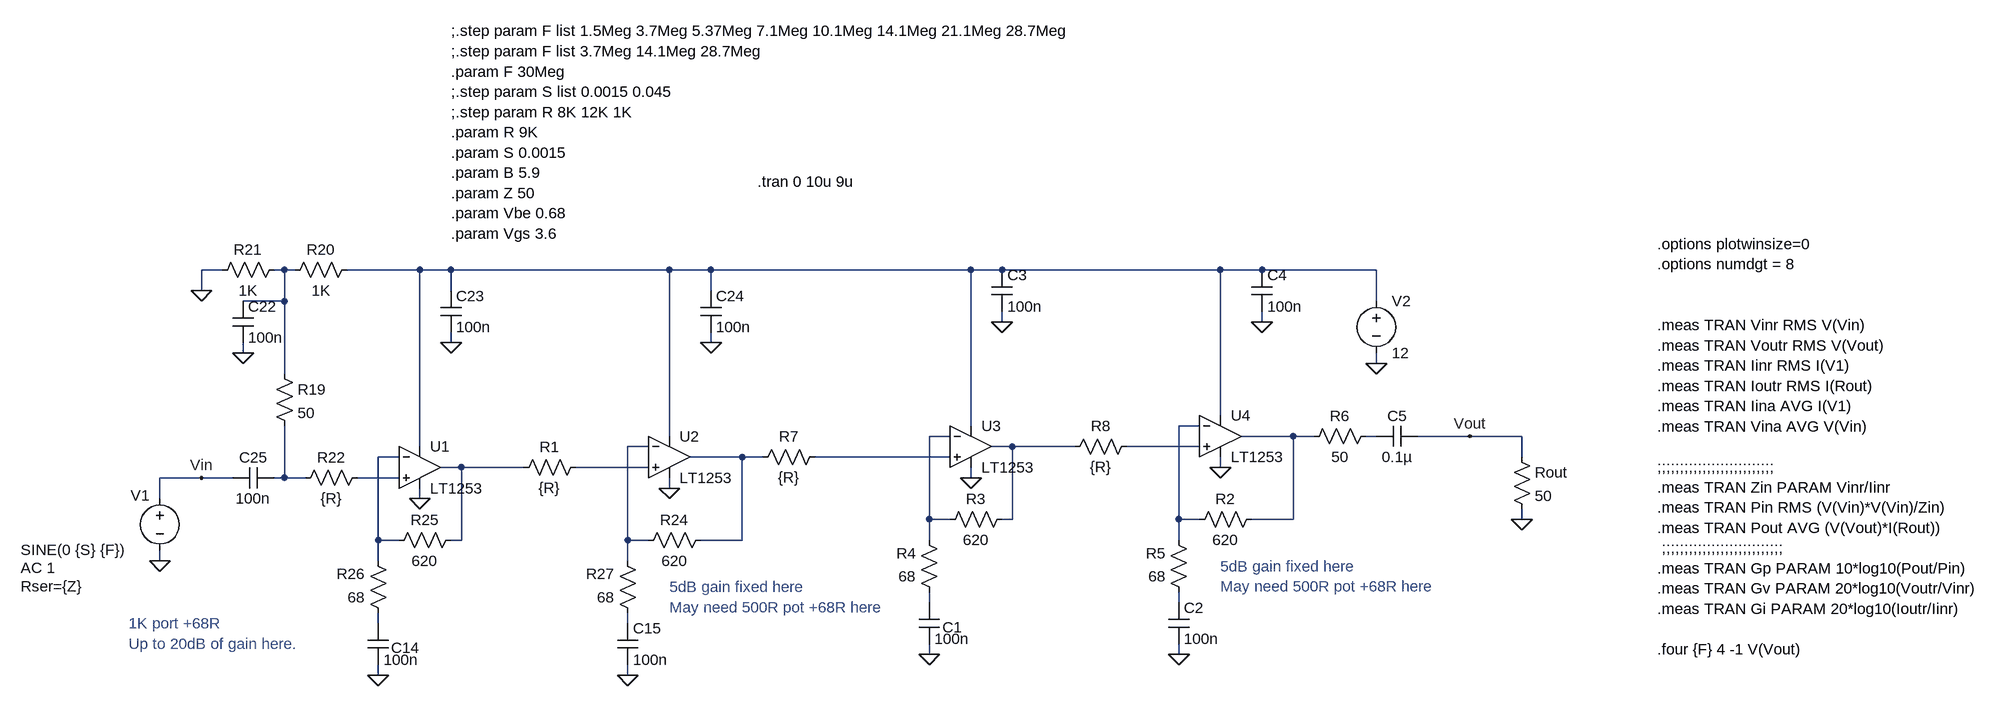
[diagram p0: schematic LT1253 testing.asc]
LT1253 testing.asc, the LTspice schematic file:
Version 4
SHEET 1 3748 1760
WIRE -2544 -288 -2576 -288
WIRE -2448 -288 -2464 -288
WIRE -2432 -288 -2448 -288
WIRE -2240 -288 -2352 -288
WIRE -2192 -288 -2240 -288
WIRE -1856 -288 -2192 -288
WIRE -1792 -288 -1856 -288
WIRE -1392 -288 -1792 -288
WIRE -1344 -288 -1392 -288
WIRE -1008 -288 -1344 -288
WIRE -944 -288 -1008 -288
WIRE -768 -288 -944 -288
WIRE -2576 -256 -2576 -288
WIRE -2192 -256 -2192 -288
WIRE -1792 -256 -1792 -288
WIRE -2448 -240 -2448 -288
WIRE -2448 -240 -2512 -240
WIRE -768 -240 -768 -288
WIRE -1344 -208 -1344 -224
WIRE -944 -208 -944 -224
WIRE -2192 -176 -2192 -192
WIRE -1792 -176 -1792 -192
WIRE -2512 -160 -2512 -176
WIRE -768 -144 -768 -160
WIRE -2448 -128 -2448 -240
WIRE -1008 -64 -1008 -288
WIRE -1392 -48 -1392 -288
WIRE -1040 -48 -1072 -48
WIRE -1856 -32 -1856 -288
WIRE -1424 -32 -1456 -32
WIRE -896 -32 -976 -32
WIRE -864 -32 -896 -32
WIRE -768 -32 -784 -32
WIRE -624 -32 -704 -32
WIRE -544 -32 -624 -32
WIRE -2240 -16 -2240 -288
WIRE -1888 -16 -1920 -16
WIRE -1328 -16 -1360 -16
WIRE -1232 -16 -1328 -16
WIRE -1040 -16 -1152 -16
WIRE -2272 0 -2304 0
WIRE -1744 0 -1824 0
WIRE -1712 0 -1744 0
WIRE -1424 0 -1632 0
WIRE -544 0 -544 -32
WIRE -2176 16 -2208 16
WIRE -2080 16 -2176 16
WIRE -1888 16 -2000 16
WIRE -1008 16 -1008 0
WIRE -2576 32 -2640 32
WIRE -2528 32 -2576 32
WIRE -2448 32 -2448 -48
WIRE -2448 32 -2464 32
WIRE -2416 32 -2448 32
WIRE -2272 32 -2336 32
WIRE -1392 32 -1392 16
WIRE -1856 48 -1856 32
WIRE -2640 64 -2640 32
WIRE -2240 64 -2240 48
WIRE -1456 96 -1456 -32
WIRE -1424 96 -1456 96
WIRE -1328 96 -1328 -16
WIRE -1328 96 -1344 96
WIRE -1072 96 -1072 -48
WIRE -1040 96 -1072 96
WIRE -896 96 -896 -32
WIRE -896 96 -960 96
WIRE -544 96 -544 80
WIRE -2304 128 -2304 0
WIRE -2272 128 -2304 128
WIRE -2176 128 -2176 16
WIRE -2176 128 -2192 128
WIRE -1920 128 -1920 -16
WIRE -1888 128 -1920 128
WIRE -1744 128 -1744 0
WIRE -1744 128 -1808 128
WIRE -1456 128 -1456 96
WIRE -1072 128 -1072 96
WIRE -2640 160 -2640 144
WIRE -2304 160 -2304 128
WIRE -1920 160 -1920 128
WIRE -1456 224 -1456 208
WIRE -1072 224 -1072 208
WIRE -2304 256 -2304 240
WIRE -1920 256 -1920 240
WIRE -1456 304 -1456 288
WIRE -1072 304 -1072 288
WIRE -2304 336 -2304 320
WIRE -1920 336 -1920 320
FLAG -2640 160 0
FLAG -2576 32 Vin
FLAG -2192 -176 0
FLAG -2512 -160 0
FLAG -2240 64 0
FLAG -1856 48 0
FLAG -1920 336 0
FLAG -1792 -176 0
FLAG -2576 -256 0
FLAG -2304 336 0
FLAG -1344 -208 0
FLAG -1392 32 0
FLAG -1008 16 0
FLAG -1072 304 0
FLAG -944 -208 0
FLAG -1456 304 0
FLAG -544 96 0
FLAG -624 -32 Vout
FLAG -768 -144 0
SYMBOL voltage -2640 48 R0
WINDOW 0 -45 11 Left 2
WINDOW 3 -214 95 Left 2
WINDOW 123 -214 123 Left 2
WINDOW 39 -214 151 Left 2
SYMATTR InstName V1
SYMATTR Value SINE(0 {S} {F})
SYMATTR Value2 AC 1
SYMATTR SpiceLine Rser={Z}
SYMBOL voltage -768 -256 R0
WINDOW 123 0 0 Left 0
WINDOW 39 0 0 Left 0
SYMATTR InstName V2
SYMATTR Value 12
SYMBOL Opamps\\LT1253 -2240 -48 R0
SYMATTR InstName U1
SYMBOL Opamps\\LT1253 -1856 -64 R0
SYMATTR InstName U2
SYMBOL res -2464 -144 R0
SYMATTR InstName R19
SYMATTR Value 50
SYMBOL res -2336 -304 R90
WINDOW 0 0 56 VBottom 2
WINDOW 3 32 56 VTop 2
SYMATTR InstName R20
SYMATTR Value 1K
SYMBOL res -2448 -304 R90
WINDOW 0 0 56 VBottom 2
WINDOW 3 32 56 VTop 2
SYMATTR InstName R21
SYMATTR Value 1K
SYMBOL res -2320 16 R90
WINDOW 0 0 56 VBottom 2
WINDOW 3 32 56 VTop 2
SYMATTR InstName R22
SYMATTR Value {R}
SYMBOL res -1792 112 R90
WINDOW 0 0 56 VBottom 2
WINDOW 3 32 56 VTop 2
SYMATTR InstName R24
SYMATTR Value 620
SYMBOL res -2176 112 R90
WINDOW 0 0 56 VBottom 2
WINDOW 3 32 56 VTop 2
SYMATTR InstName R25
SYMATTR Value 620
SYMBOL res -2288 256 R180
WINDOW 0 36 76 Left 2
WINDOW 3 36 40 Left 2
SYMATTR InstName R26
SYMATTR Value 68
SYMBOL res -1904 256 R180
WINDOW 0 36 76 Left 2
WINDOW 3 36 40 Left 2
SYMATTR InstName R27
SYMATTR Value 68
SYMBOL cap -2320 256 R0
WINDOW 0 36 38 Left 2
SYMATTR InstName C14
SYMATTR Value 100n
SYMBOL cap -1936 256 R0
SYMATTR InstName C15
SYMATTR Value 100n
SYMBOL cap -2528 -240 R0
SYMATTR InstName C22
SYMATTR Value 100n
SYMBOL cap -2208 -256 R0
SYMATTR InstName C23
SYMATTR Value 100n
SYMBOL cap -1808 -256 R0
SYMATTR InstName C24
SYMATTR Value 100n
SYMBOL cap -2464 16 R90
WINDOW 0 0 32 VBottom 2
WINDOW 3 32 32 VTop 2
SYMATTR InstName C25
SYMATTR Value 100n
SYMBOL Opamps\\LT1253 -1392 -80 R0
SYMATTR InstName U3
SYMBOL Opamps\\LT1253 -1008 -96 R0
SYMATTR InstName U4
SYMBOL res -944 80 R90
WINDOW 0 0 56 VBottom 2
WINDOW 3 32 56 VTop 2
SYMATTR InstName R2
SYMATTR Value 620
SYMBOL res -1328 80 R90
WINDOW 0 0 56 VBottom 2
WINDOW 3 32 56 VTop 2
SYMATTR InstName R3
SYMATTR Value 620
SYMBOL res -1440 224 R180
WINDOW 0 36 76 Left 2
WINDOW 3 36 40 Left 2
SYMATTR InstName R4
SYMATTR Value 68
SYMBOL res -1056 224 R180
WINDOW 0 36 76 Left 2
WINDOW 3 36 40 Left 2
SYMATTR InstName R5
SYMATTR Value 68
SYMBOL cap -1472 224 R0
WINDOW 0 36 38 Left 2
SYMATTR InstName C1
SYMATTR Value 100n
SYMBOL cap -1088 224 R0
SYMATTR InstName C2
SYMATTR Value 100n
SYMBOL cap -1360 -288 R0
SYMATTR InstName C3
SYMATTR Value 100n
SYMBOL cap -960 -288 R0
SYMATTR InstName C4
SYMATTR Value 100n
SYMBOL res -768 -48 R90
WINDOW 0 0 56 VBottom 2
WINDOW 3 32 56 VTop 2
SYMATTR InstName R6
SYMATTR Value 50
SYMBOL cap -704 -48 R90
WINDOW 0 0 32 VBottom 2
WINDOW 3 32 32 VTop 2
SYMATTR InstName C5
SYMATTR Value 0.1µ
SYMBOL res -560 -16 R0
SYMATTR InstName Rout
SYMATTR Value 50
SYMBOL res -1984 0 R90
WINDOW 0 0 56 VBottom 2
WINDOW 3 32 56 VTop 2
SYMATTR InstName R1
SYMATTR Value {R}
SYMBOL res -1616 -16 R90
WINDOW 0 0 56 VBottom 2
WINDOW 3 32 56 VTop 2
SYMATTR InstName R7
SYMATTR Value {R}
SYMBOL res -1136 -32 R90
WINDOW 0 0 56 VBottom 2
WINDOW 3 32 56 VTop 2
SYMATTR InstName R8
SYMATTR Value {R}
TEXT -336 -328 Left 2 !.options plotwinsize=0\n.options numdgt = 8\n \n \n.meas TRAN Vinr RMS V(Vin)\n.meas TRAN Voutr RMS V(Vout)\n.meas TRAN Iinr RMS I(V1)\n.meas TRAN Ioutr RMS I(Rout)\n.meas TRAN Iina AVG I(V1)\n.meas TRAN Vina AVG V(Vin)\n \n;;;;;;;;;;;;;;;;;;;;;;;;;;\n.meas TRAN Zin PARAM Vinr/Iinr\n.meas TRAN Pin RMS (V(Vin)*V(Vin)/Zin)\n.meas TRAN Pout AVG (V(Vout)*I(Rout))\n ;;;;;;;;;;;;;;;;;;;;;;;;;;;\n.meas TRAN Gp PARAM 10*log10(Pout/Pin)\n.meas TRAN Gv PARAM 20*log10(Voutr/Vinr)\n.meas TRAN Gi PARAM 20*log10(Ioutr/Iinr)\n \n.four {F} 4 -1 V(Vout)
TEXT -2192 -656 Left 2 !;.step param F list 1.5Meg 3.7Meg 5.37Meg 7.1Meg 10.1Meg 14.1Meg 21.1Meg 28.7Meg\n;.step param F list 3.7Meg 14.1Meg 28.7Meg\n.param F 30Meg\n;.step param S list 0.0015 0.045\n;.step param R 8K 12K 1K\n.param R 9K\n.param S 0.0015\n.param B 5.9\n.param Z 50\n.param Vbe 0.68\n.param Vgs 3.6
TEXT -1856 200 Left 2 ;5dB gain fixed here\nMay need 500R pot +68R here
TEXT -2688 256 Left 2 ;1K port +68R  \nUp to 20dB of gain here.
TEXT -1008 168 Left 2 ;5dB gain fixed here\nMay need 500R pot +68R here
TEXT -1720 -424 Left 2 !.tran 0 10u 9u

The netlist it stands for:
* LT1253 testing.asc
V1 Vin 0 SINE(0 {S} {F}) AC 1 Rser={Z}
V2 N002 0 12
XU1 N016 N010 N002 0 N013 LT1253  ; pins In+ In- V+ V- OUT
XU2 N014 N007 N002 0 N011 LT1253  ; pins In+ In- V+ V- OUT
R19 N001 N015 50
R20 N002 N001 1K
R21 N001 0 1K
R22 N016 N015 {R}
R24 N011 N007 620
R25 N013 N010 620
R26 N019 N010 68
R27 N020 N007 68
C14 N019 0 100n
C15 N020 0 100n
C22 N001 0 100n
C23 N002 0 100n
C24 N002 0 100n
C25 N015 Vin 100n
XU3 N012 N004 N002 0 N008 LT1253  ; pins In+ In- V+ V- OUT
XU4 N009 N003 N002 0 N005 LT1253  ; pins In+ In- V+ V- OUT
R2 N005 N003 620
R3 N008 N004 620
R4 N017 N004 68
R5 N018 N003 68
C1 N017 0 100n
C2 N018 0 100n
C3 N002 0 100n
C4 N002 0 100n
R6 N006 N005 50
C5 Vout N006 0.1µ
Rout Vout 0 50
R1 N014 N013 {R}
R7 N012 N011 {R}
R8 N009 N008 {R}
.options plotwinsize=0
.options numdgt = 8
.meas TRAN Vinr RMS V(Vin)
.meas TRAN Voutr RMS V(Vout)
.meas TRAN Iinr RMS I(V1)
.meas TRAN Ioutr RMS I(Rout)
.meas TRAN Iina AVG I(V1)
.meas TRAN Vina AVG V(Vin)
;;;;;;;;;;;;;;;;;;;;;;;;;;
.meas TRAN Zin PARAM Vinr/Iinr
.meas TRAN Pin RMS (V(Vin)*V(Vin)/Zin)
.meas TRAN Pout AVG (V(Vout)*I(Rout))
 ;;;;;;;;;;;;;;;;;;;;;;;;;;;
.meas TRAN Gp PARAM 10*log10(Pout/Pin)
.meas TRAN Gv PARAM 20*log10(Voutr/Vinr)
.meas TRAN Gi PARAM 20*log10(Ioutr/Iinr)
.four {F} 4 -1 V(Vout)
;.step param F list 1.5Meg 3.7Meg 5.37Meg 7.1Meg 10.1Meg 14.1Meg 21.1Meg 28.7Meg
;.step param F list 3.7Meg 14.1Meg 28.7Meg
.param F 30Meg
;.step param S list 0.0015 0.045
;.step param R 8K 12K 1K
.param R 9K
.param S 0.0015
.param B 5.9
.param Z 50
.param Vbe 0.68
.param Vgs 3.6
* 5dB gain fixed here
* May need 500R pot +68R here
* 1K port +68R
* Up to 20dB of gain here.
* 5dB gain fixed here
* May need 500R pot +68R here
.tran 0 10u 9u
.backanno
.end